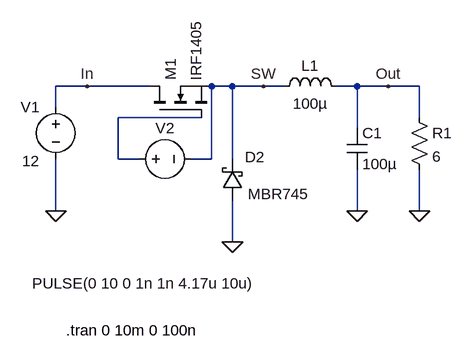
[diagram p0: schematic DC Buck Convertor.asc]
DC Buck Convertor.asc, the LTspice schematic file:
Version 4.1
SHEET 1 1136 680
WIRE 128 96 80 96
WIRE 224 96 128 96
WIRE 352 96 320 96
WIRE 400 96 352 96
WIRE 432 96 400 96
WIRE 544 96 512 96
WIRE 592 96 544 96
WIRE 640 96 592 96
WIRE 80 128 80 96
WIRE 304 144 176 144
WIRE 640 144 640 96
WIRE 544 160 544 96
WIRE 176 208 176 144
WIRE 208 208 176 208
WIRE 320 208 320 96
WIRE 320 208 288 208
WIRE 352 208 352 96
WIRE 80 288 80 208
WIRE 544 288 544 224
WIRE 640 288 640 224
WIRE 352 336 352 272
FLAG 80 288 0
FLAG 352 336 0
FLAG 640 288 0
FLAG 544 288 0
FLAG 592 96 Out
FLAG 400 96 SW
FLAG 128 96 In
SYMBOL voltage 80 112 R0
WINDOW 0 -54 16 Left 2
WINDOW 3 -52 99 Left 2
WINDOW 123 0 0 Left 0
WINDOW 39 0 0 Left 0
SYMATTR InstName V1
SYMATTR Value 12
SYMBOL nmos 224 144 R270
WINDOW 0 57 33 Left 2
SYMATTR InstName M1
SYMATTR Value IRF1405
SYMBOL schottky 368 272 R180
WINDOW 0 -34 67 Left 2
WINDOW 3 -102 10 Left 2
SYMATTR InstName D2
SYMATTR Value MBR745
SYMATTR Description Diode
SYMATTR Type diode
SYMBOL ind 416 112 R270
WINDOW 0 32 56 VTop 2
WINDOW 3 5 56 VBottom 2
SYMATTR InstName L1
SYMATTR Value 100µ
SYMATTR SpiceLine Rser=1m
SYMBOL cap 528 160 R0
SYMATTR InstName C1
SYMATTR Value 100µ
SYMBOL res 624 128 R0
SYMATTR InstName R1
SYMATTR Value 6
SYMBOL voltage 192 208 R270
WINDOW 0 32 56 VTop 2
WINDOW 3 -176 24 VBottom 2
WINDOW 123 0 0 Left 0
WINDOW 39 0 0 Left 0
SYMATTR InstName V2
SYMATTR Value PULSE(0 10 0 1n 1n 4.17u 10u)
TEXT 96 472 Left 2 !.tran 0 10m 0 100n

The netlist it stands for:
* DC Buck Convertor.asc
V1 In 0 12
M1 In N001 SW SW IRF1405
D2 0 SW MBR745
L1 SW Out 100µ Rser=1m
C1 Out 0 100µ
R1 Out 0 6
V2 N001 SW PULSE(0 10 0 1n 1n 4.17u 10u)
.model D D
.lib standard.dio
.model NMOS NMOS
.model PMOS PMOS
.lib standard.mos
.tran 0 10m 0 100n
.backanno
.end